# Altium schematic sheet Main_doc.SchDoc: Title
size 431 x 279 mm; Date: *******; ApprovedBy: *******; CheckedBy: Dahami Fernando; Author: *******; CompanyName: *******; DrawnBy: Rivikula Fernando; Engineer: *******; Organization: *******; Address1: *******; Address2: *******; Address3: *******; Address4: *******; DocumentNumber: 1; Revision: *******; SheetNumber: 1; SheetTotal: 7; Subtitle: Main; Project: Distotion_Gitar_Pedal; VersionRevision: 1; TotalSheet: 8; CurrentTime: *******; CurrentDate: *******; Time: *******; DocumentFullPathAndName: *******; DocumentName: *******; ModifiedDate: *******; ImagePath: *******; ProjectName: *******; Application_BuildNumber: *******
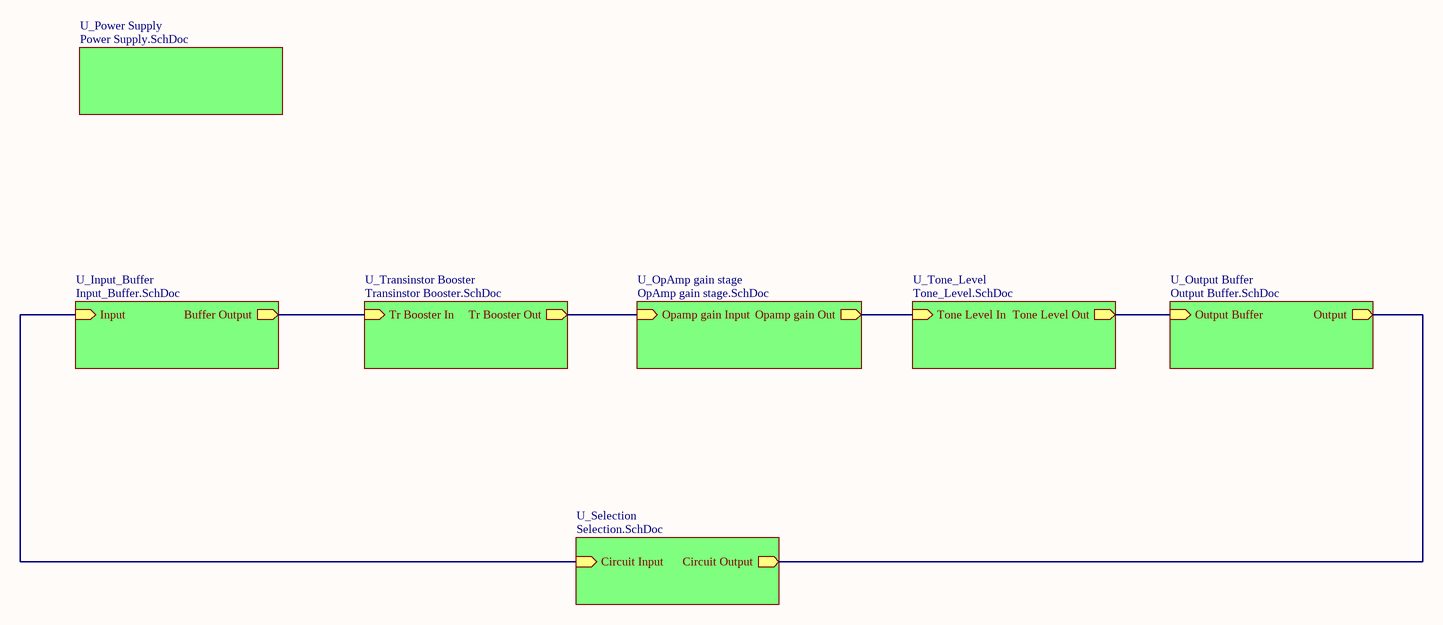
[diagram p0: Main_doc.SchDoc]

## Sub-sheets
U_Input_Buffer = Input_Buffer.SchDoc: Input (in), Buffer Output (out)
U_OpAmp gain stage = OpAmp gain stage.SchDoc: Opamp gain Input (in), Opamp gain Out (out)
U_Output Buffer = Output Buffer.SchDoc: Output Buffer (in), Output (out)
U_Power Supply = Power Supply.SchDoc: no entries
U_Selection = Selection.SchDoc: Circuit Input (in), Circuit Output (out)
U_Tone_Level = Tone_Level.SchDoc: Tone Level In (in), Tone Level Out (out)
U_Transinstor Booster = Transinstor Booster.SchDoc: Tr Booster In (in), Tr Booster Out (out)

## Nets
(unnamed): sheet U_Input_Buffer/Input, sheet U_Selection/Circuit Input
(unnamed): sheet U_Input_Buffer/Buffer Output, sheet U_Transinstor Booster/Tr Booster In
(unnamed): sheet U_Transinstor Booster/Tr Booster Out, sheet U_OpAmp gain stage/Opamp gain Input
(unnamed): sheet U_OpAmp gain stage/Opamp gain Out, sheet U_Tone_Level/Tone Level In
(unnamed): sheet U_Tone_Level/Tone Level Out, sheet U_Output Buffer/Output Buffer
(unnamed): sheet U_Output Buffer/Output, sheet U_Selection/Circuit Output

## Notes on the sheet
- DWG. NO.
- REV.
- SHT.
- THIS DOCUMENT AND THE DATA DISCLOSED HEREIN OR HEREWITH IS THE PROPERTY OF ALTIUM LIMITED AND MAY BE FREELY DISTRIBUTED IN WHOLE. NO RIGHTS ARE RESERVED OR EXPRESS OR IMPLIED WARANTEE GIVEN.
- REVISION
- DESCRIPTION
- DATE
- APPROVED
- ENG:
- APPROVALS
- PROJECT
- DSN:
- CHK:
- REFERENCE DOCUMENTS
- PROJECT REVISION:
- TITLE
- DOCUMENT REVISION:
- DESIGN ITEM:
- BOM:
- FAB DWG:
- PCB DWG:
- ASSY DWG:
- SCALE:
- SIZE
- B
- CAGE CODE
- FILE NAME
- DWG NO.
- SHEET
- OF
- REV